# Altium schematic sheet Excavator_SEMA.SchDoc
size A4; SheetNumber: 1; SheetTotal: 1
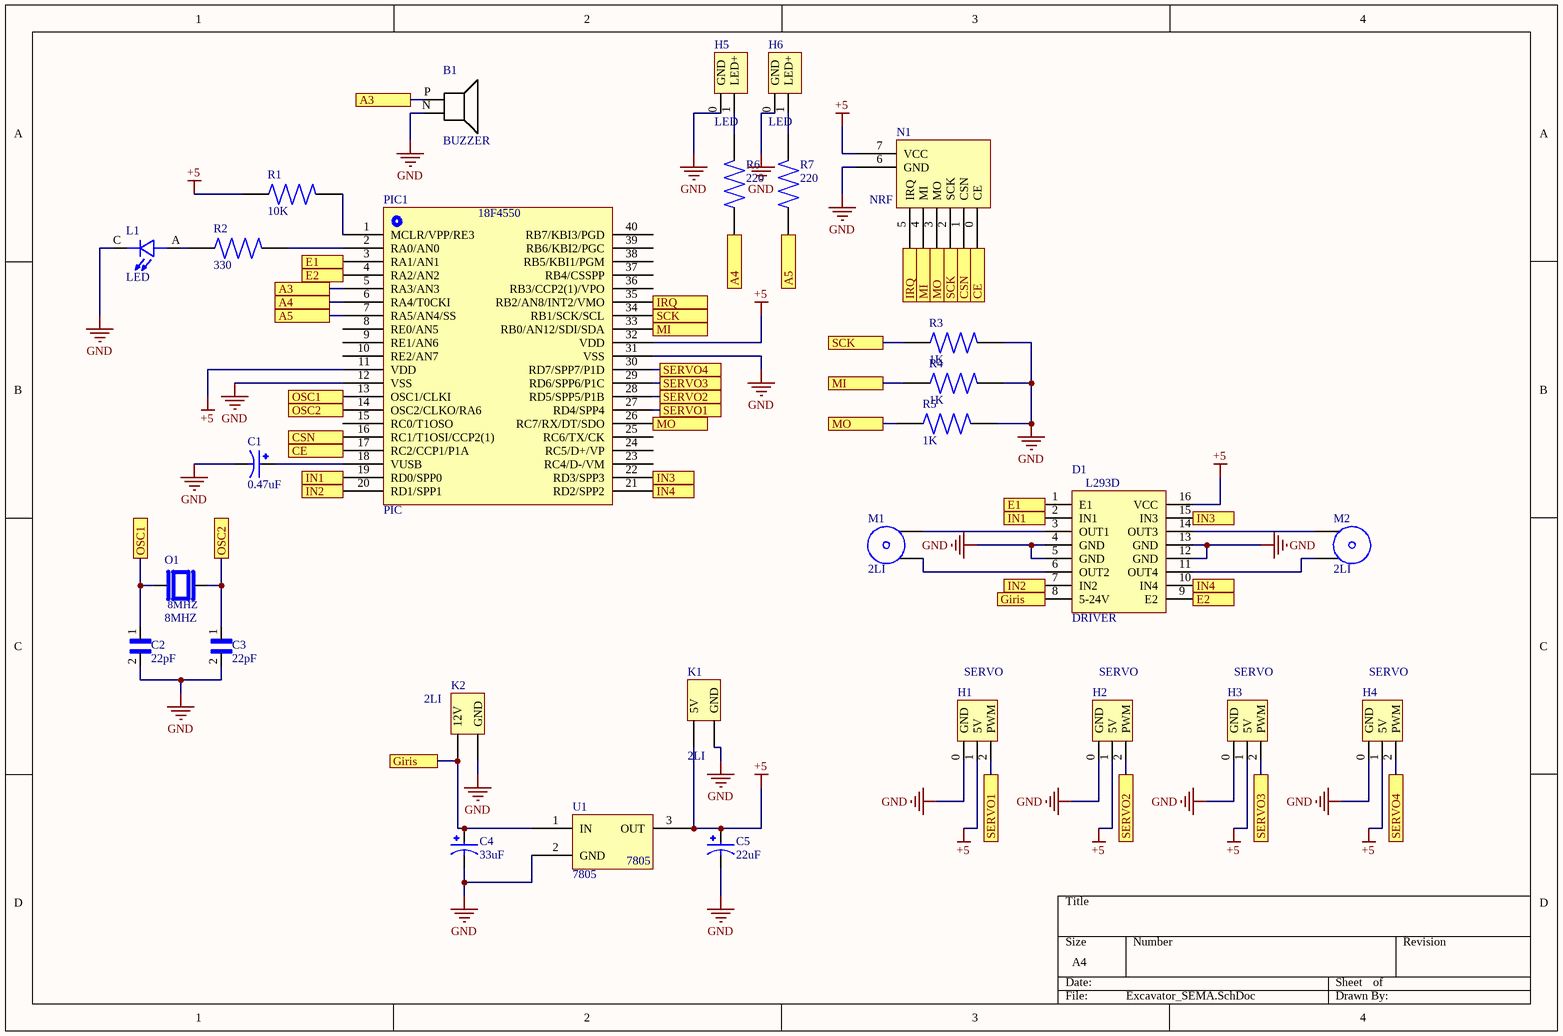
[diagram p0: Excavator_SEMA.SchDoc]

## Parts
B1  BUZZER  [buzzer]
C1  0.47uF  [CAP]
C2  22pF  [22pF]
C3  22pF  [22pF]
C4  33uF  [CAP]
C5  22uF  [CAP]
D1  DRIVER  [L293D]
H1  SERVO  [HEADER1x3]
H2  SERVO  [HEADER1x3]
H3  SERVO  [HEADER1x3]
H4  SERVO  [HEADER1x3]
H5  LED  [HEADER1x2]
H6  LED  [HEADER1x2]
K1  2LI  [klemens2li]
K2  2LI  [klemens12V]
L1  LED  [LED_GREEN]
M1  2LI  [klemensMOTOR]
M2  2LI  [klemensMOTOR]
N1  NRF  [NRF24L01]
O1  8MHZ  [8MHZ]
PIC1  PIC  [PIC18F4550]
R1  10K  [10K_RES]
R2  330  [330_RES]
R3  1K  [1K_RES]
R4  1K  [1K_RES]
R5  1K  [1K_RES]
R6  220  [220_RES]
R7  220  [220_RES]
U1  7805  [7805]

## Ports
A3, A4, A5, CE, CSN, E1, E2, Giris, IN1, IN2, IN3, IN4, IRQ, MI, MO, OSC1, OSC2, SCK, SERVO1, SERVO2, SERVO3, SERVO4

## Nets
+5: C5.P D1.16(VCC) H1.1(5V) H2.1(5V) H3.1(5V) H4.1(5V) K1.P(5V) N1.7(VCC) PIC1.11(VDD) PIC1.32(VDD) R1.1 U1.3(OUT)
GND: B1.N C1.N C2.2 C3.2 C4.N C5.N D1.4(GND) D1.5(GND) D1.12(GND) D1.13(GND) H1.0(GND) H2.0(GND) H3.0(GND) H4.0(GND) H5.0(GND) H6.0(GND) K1.N(GND) K2.N(GND) L1.C N1.6(GND) PIC1.12(VSS) PIC1.31(VSS) R3.2 R4.2 R5.2 U1.2(GND)
A3: B1.P PIC1.5(RA3/AN3) ; port A3
A4: PIC1.6(RA4/T0CKI) R6.1 ; port A4
A5: PIC1.7(RA5/AN4/SS) R7.1 ; port A5
CE: N1.0(CE) PIC1.17(RC2/CCP1/P1A) ; port CE
CSN: N1.1(CSN) PIC1.16(RC1/T1OSI/CCP2(1)) ; port CSN
E1: D1.1(E1) PIC1.3(RA1/AN1) ; port E1
E2: D1.9(E2) PIC1.4(RA2/AN2) ; port E2
Giris: C4.P D1.8(5-24V) K2.P(12V) U1.1(IN) ; port Giris
IN1: D1.2(IN1) PIC1.19(RD0/SPP0) ; port IN1
IN2: D1.7(IN2) PIC1.20(RD1/SPP1) ; port IN2
IN3: D1.15(IN3) PIC1.22(RD3/SPP3) ; port IN3
IN4: D1.10(IN4) PIC1.21(RD2/SPP2) ; port IN4
IRQ: N1.5(IRQ) PIC1.35(RB2/AN8/INT2/VMO) ; port IRQ
MI: N1.4(MI) PIC1.33(RB0/AN12/SDI/SDA) R4.1 ; port MI
MO: N1.3(MO) PIC1.26(RC7/RX/DT/SDO) R5.1 ; port MO
OSC1: C2.1 O1.1 PIC1.13(OSC1/CLKI) ; port OSC1
OSC2: C3.1 O1.2 PIC1.14(OSC2/CLKO/RA6) ; port OSC2
SCK: N1.2(SCK) PIC1.34(RB1/SCK/SCL) R3.1 ; port SCK
SERVO1: H1.2(PWM) PIC1.27(RD4/SPP4) ; port SERVO1
SERVO2: H2.2(PWM) PIC1.28(RD5/SPP5/P1B) ; port SERVO2
SERVO3: H3.2(PWM) PIC1.29(RD6/SPP6/P1C) ; port SERVO3
SERVO4: H4.2(PWM) PIC1.30(RD7/SPP7/P1D) ; port SERVO4
NetC1_P: C1.P PIC1.18(VUSB)
NetD1_3: D1.3(OUT1) M1.P(I)
NetD1_6: D1.6(OUT2) M1.N(G)
NetD1_11: D1.11(OUT4) M2.P(I)
NetD1_14: D1.14(OUT3) M2.N(G)
NetH5_1: H5.1(LED+) R6.2
NetH6_1: H6.1(LED+) R7.2
NetL1_A: L1.A R2.1
NetPIC1_1: PIC1.1(MCLR/VPP/RE3) R1.2
NetPIC1_2: PIC1.2(RA0/AN0) R2.2

Not connected (* = marked no-connect by the designer): PIC1 8(RE0/AN5) 9(RE1/AN6) 10(RE2/AN7) 15(RC0/T1OSO) 23(RC4/D-/VM) 24(RC5/D+/VP) 25(RC6/TX/CK) 36(RB3/CCP2(1)/VPO) 37(RB4/CSSPP) 38(RB5/KBI1/PGM) 39(RB6/KBI2/PGC) 40(RB7/KBI3/PGD)

## Notes on the sheet
- (in symbol PIC18f4550) 18F4550

## Library data of the parts
D1 = L293D
H1-H4 = HEADER1x3
H5 H6 = HEADER1x2
K1 = KLEMENS2LI
K2 = KLEMENS12V
L1 = LED_GREEN
M1 M2 = KLEMENSMOTOR
N1 = NRF24L01
PIC1 = PIC18f4550
R1 = 10K_RES
R2 = 330_RES
R3-R5 = 1K_RES
R6 R7 = 220_RES